# EAGLE schematic NYclock2 (EAGLE 7.2.0)
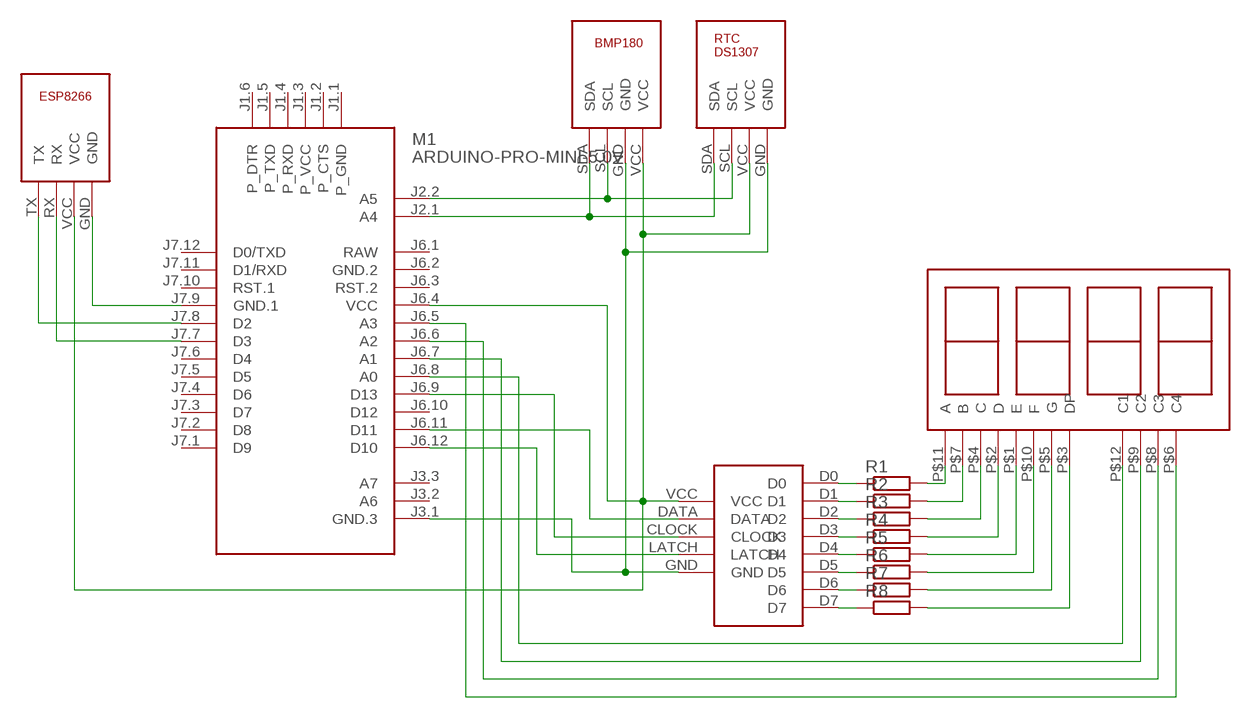
[diagram p0: schematic, sheet 1]

## Parts
1  SHIFTREG  [SHIFTREG]
M1  ARDUINO-PRO-MINI-5.0V  [ARDUINO-PRO-MINI]
R1  R-EU_0204/2V  [0204V]
R2  R-EU_0204/2V  [0204V]
R3  R-EU_0204/2V  [0204V]
R4  R-EU_0204/2V  [0204V]
R5  R-EU_0204/2V  [0204V]
R6  R-EU_0204/2V  [0204V]
R7  R-EU_0204/2V  [0204V]
R8  R-EU_0204/2V  [0204V]
U$1  BMP180  [BMP180]
U$2  7SEGDIGITS  [7SEGDIGITS]
U$3  ESP8266  [ESP8266]
U$4  RTC  [RTC]

## Nets
N$1: 1.GND M1.J3.1(GND.3) U$1.GND U$4.GND
N$2: 1.VCC M1.J6.4(VCC) U$1.VCC U$3.VCC U$4.VCC
N$3: M1.J7.8(D2) U$3.TX
N$4: M1.J7.7(D3) U$3.RX
N$5: 1.DATA M1.J6.11(D11)
N$6: 1.CLOCK M1.J6.9(D13)
N$7: 1.LATCH M1.J6.12(D10)
N$8: 1.D0 R1.1
N$9: 1.D1 R2.1
N$10: 1.D2 R3.1
N$11: 1.D3 R4.1
N$12: 1.D4 R5.1
N$13: 1.D5 R6.1
N$14: 1.D6 R7.1
N$15: 1.D7 R8.1
N$16: R1.2 U$2.P$11(A)
N$17: R2.2 U$2.P$7(B)
N$18: R3.2 U$2.P$4(C)
N$19: R4.2 U$2.P$2(D)
N$20: R5.2 U$2.P$1(E)
N$21: R6.2 U$2.P$10(F)
N$22: R7.2 U$2.P$5(G)
N$23: R8.2 U$2.P$3(DP)
N$24: M1.J6.5(A3) U$2.P$6(C4)
N$25: M1.J6.6(A2) U$2.P$8(C3)
N$26: M1.J6.7(A1) U$2.P$9(C2)
N$27: M1.J6.8(A0) U$2.P$12(C1)
N$28: M1.J2.2(A5) U$1.SCL U$4.SCL
N$29: M1.J2.1(A4) U$1.SDA U$4.SDA
N$30: M1.J7.9(GND.1) U$3.GND
Unconnected: M1.J1.1(P_GND) M1.J1.2(P_CTS) M1.J1.3(P_VCC) M1.J1.4(P_RXD) M1.J1.5(P_TXD) M1.J1.6(P_DTR) M1.J3.2(A6) M1.J3.3(A7) M1.J6.3(RST.2) M1.J6.10(D12) M1.J7.1(D9) M1.J7.2(D8) M1.J7.3(D7) M1.J7.4(D6) M1.J7.5(D5) M1.J7.6(D4) M1.J7.10(RST.1) M1.J7.11(D1/RXD) M1.J7.12(D0/TXD)

## Power pins joined to a net without a drawn wire
GND.2: M1.J6.2(GND.2)
RAW: M1.J6.1(RAW)

## Library data of the parts
1 = NYclock:SHIFTREG
M1 = diy-modules:ARDUINO-PRO-MINI-*: Arduino Pro Mini
R1-R8 = rcl:R-EU_: RESISTOR, European symbol
U$1 = NYclock:BMP180
U$2 = NYclock:7SEGDIGITS
U$3 = NYclock:ESP8266
U$4 = NYclock:RTC